# Altium schematic sheet Encoders.SchDoc: Arm - PWM Encoders
size Letter; DrawnBy: K.Hong; Organization: UW Robotics; Address1: 200 University Avenue; Address2: Waterloo; Address3: Ontario; Address4: Canada N2L 3G6; SheetNumber: 8; SheetTotal: 9
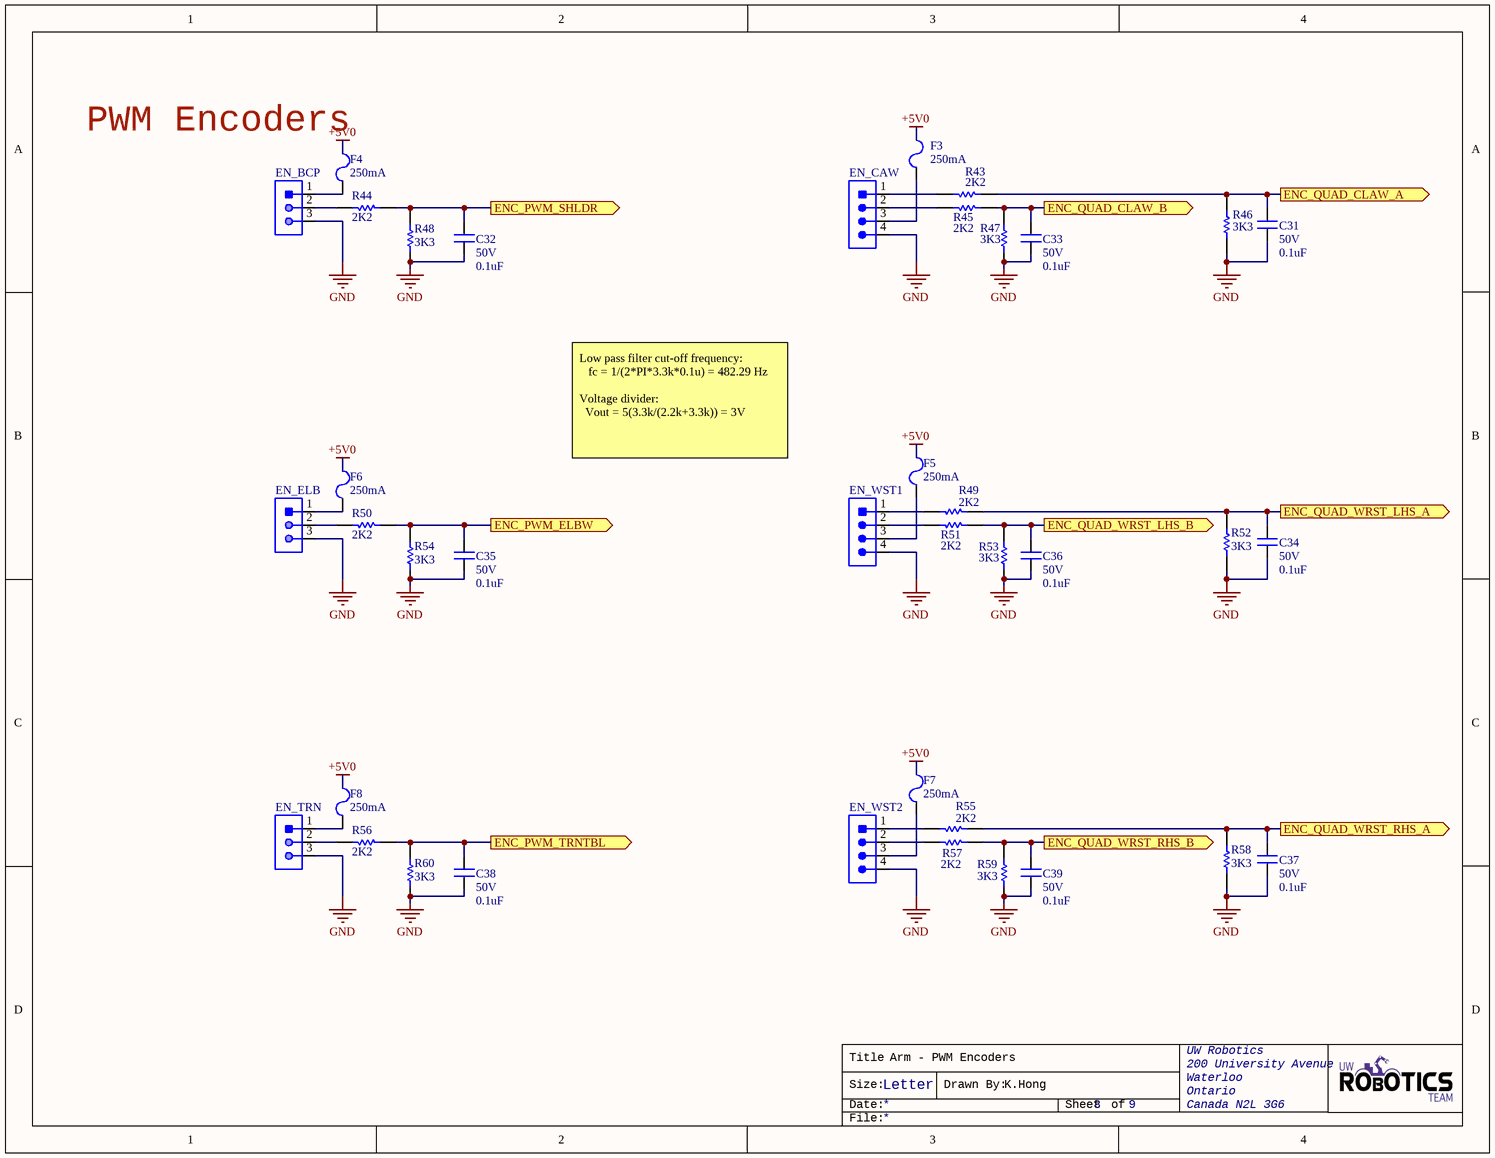
[diagram p0: Encoders.SchDoc]

## Parts
C31  value 0.1uF  Voltage Rating: 50V  [CAPC0603(1608)55_N]  (hidden comment: CAP_0.1uF_50V_0603)
C32  value 0.1uF  Voltage Rating: 50V  [CAPC0603(1608)55_N]  (hidden comment: CAP_0.1uF_50V_0603)
C33  value 0.1uF  Voltage Rating: 50V  [CAPC0603(1608)55_N]  (hidden comment: CAP_0.1uF_50V_0603)
C34  value 0.1uF  Voltage Rating: 50V  [CAPC0603(1608)55_N]  (hidden comment: CAP_0.1uF_50V_0603)
C35  value 0.1uF  Voltage Rating: 50V  [CAPC0603(1608)55_N]  (hidden comment: CAP_0.1uF_50V_0603)
C36  value 0.1uF  Voltage Rating: 50V  [CAPC0603(1608)55_N]  (hidden comment: CAP_0.1uF_50V_0603)
C37  value 0.1uF  Voltage Rating: 50V  [CAPC0603(1608)55_N]  (hidden comment: CAP_0.1uF_50V_0603)
C38  value 0.1uF  Voltage Rating: 50V  [CAPC0603(1608)55_N]  (hidden comment: CAP_0.1uF_50V_0603)
C39  value 0.1uF  Voltage Rating: 50V  [CAPC0603(1608)55_N]  (hidden comment: CAP_0.1uF_50V_0603)
EN_BCP  CON_3M_SM4  [JST-B3B-SM4-TB]  (value not drawn)
EN_CAW  CON_4M_SM4  [JST-B4B-SM4-TB]  (value not drawn)
EN_ELB  CON_3M_SM4  [JST-B3B-SM4-TB]  (value not drawn)
EN_TRN  CON_3M_SM4  [JST-B3B-SM4-TB]  (value not drawn)
EN_WST1  CON_4M_SM4  [JST-B4B-SM4-TB]  (value not drawn)
EN_WST2  CON_4M_SM4  [JST-B4B-SM4-TB]  (value not drawn)
F3  Current Rating: 250mA  [FUSE_0603]  (hidden comment: FUSE_250mA_0603)
F4  Current Rating: 250mA  [FUSE_0603]  (hidden comment: FUSE_250mA_0603)
F5  Current Rating: 250mA  [FUSE_0603]  (hidden comment: FUSE_250mA_0603)
F6  Current Rating: 250mA  [FUSE_0603]  (hidden comment: FUSE_250mA_0603)
F7  Current Rating: 250mA  [FUSE_0603]  (hidden comment: FUSE_250mA_0603)
F8  Current Rating: 250mA  [FUSE_0603]  (hidden comment: FUSE_250mA_0603)
R43  value 2K2  [RESC0603(1608)_N]  (hidden comment: RES_2K2_0603)
R44  value 2K2  [RESC0603(1608)_N]  (hidden comment: RES_2K2_0603)
R45  value 2K2  [RESC0603(1608)_N]  (hidden comment: RES_2K2_0603)
R46  value 3K3  [RESC0603(1608)_N]  (hidden comment: RES_3K3_0603)
R47  value 3K3  [RESC0603(1608)_N]  (hidden comment: RES_3K3_0603)
R48  value 3K3  [RESC0603(1608)_N]  (hidden comment: RES_3K3_0603)
R49  value 2K2  [RESC0603(1608)_N]  (hidden comment: RES_2K2_0603)
R50  value 2K2  [RESC0603(1608)_N]  (hidden comment: RES_2K2_0603)
R51  value 2K2  [RESC0603(1608)_N]  (hidden comment: RES_2K2_0603)
R52  value 3K3  [RESC0603(1608)_N]  (hidden comment: RES_3K3_0603)
R53  value 3K3  [RESC0603(1608)_N]  (hidden comment: RES_3K3_0603)
R54  value 3K3  [RESC0603(1608)_N]  (hidden comment: RES_3K3_0603)
R55  value 2K2  [RESC0603(1608)_N]  (hidden comment: RES_2K2_0603)
R56  value 2K2  [RESC0603(1608)_N]  (hidden comment: RES_2K2_0603)
R57  value 2K2  [RESC0603(1608)_N]  (hidden comment: RES_2K2_0603)
R58  value 3K3  [RESC0603(1608)_N]  (hidden comment: RES_3K3_0603)
R59  value 3K3  [RESC0603(1608)_N]  (hidden comment: RES_3K3_0603)
R60  value 3K3  [RESC0603(1608)_N]  (hidden comment: RES_3K3_0603)

## Ports
ENC_PWM_ELBW (out), ENC_PWM_SHLDR (out), ENC_PWM_TRNTBL (out), ENC_QUAD_CLAW_A (out), ENC_QUAD_CLAW_B (out), ENC_QUAD_WRST_LHS_A (out), ENC_QUAD_WRST_LHS_B (out), ENC_QUAD_WRST_RHS_A (out), ENC_QUAD_WRST_RHS_B (out)

## Nets
+5V0: F3.2 F4.2 F5.2 F6.2 F7.2 F8.2
GND: C31.1 C32.1 C33.1 C34.1 C35.1 C36.1 C37.1 C38.1 C39.1 EN_BCP.3 EN_CAW.4 EN_ELB.3 EN_TRN.3 EN_WST1.4 EN_WST2.4 R46.1 R47.1 R48.1 R52.1 R53.1 R54.1 R58.1 R59.1 R60.1
ENC_PWM_ELBW: C35.2 R50.1 R54.2 ; port ENC_PWM_ELBW
ENC_PWM_SHLDR: C32.2 R44.1 R48.2 ; port ENC_PWM_SHLDR
ENC_PWM_TRNTBL: C38.2 R56.1 R60.2 ; port ENC_PWM_TRNTBL
ENC_QUAD_CLAW_A: C31.2 R43.1 R46.2 ; port ENC_QUAD_CLAW_A
ENC_QUAD_CLAW_B: C33.2 R45.1 R47.2 ; port ENC_QUAD_CLAW_B
ENC_QUAD_WRST_LHS_A: C34.2 R49.1 R52.2 ; port ENC_QUAD_WRST_LHS_A
ENC_QUAD_WRST_LHS_B: C36.2 R51.1 R53.2 ; port ENC_QUAD_WRST_LHS_B
ENC_QUAD_WRST_RHS_A: C37.2 R55.1 R58.2 ; port ENC_QUAD_WRST_RHS_A
ENC_QUAD_WRST_RHS_B: C39.2 R57.1 R59.2 ; port ENC_QUAD_WRST_RHS_B
NetEN_BCP_1: EN_BCP.1 F4.1
NetEN_BCP_2: EN_BCP.2 R44.2
NetEN_CAW_1: EN_CAW.1 R43.2
NetEN_CAW_2: EN_CAW.2 R45.2
NetEN_CAW_3: EN_CAW.3 F3.1
NetEN_ELB_1: EN_ELB.1 F6.1
NetEN_ELB_2: EN_ELB.2 R50.2
NetEN_TRN_1: EN_TRN.1 F8.1
NetEN_TRN_2: EN_TRN.2 R56.2
NetEN_WST1_1: EN_WST1.1 R49.2
NetEN_WST1_2: EN_WST1.2 R51.2
NetEN_WST1_3: EN_WST1.3 F5.1
NetEN_WST2_1: EN_WST2.1 R55.2
NetEN_WST2_2: EN_WST2.2 R57.2
NetEN_WST2_3: EN_WST2.3 F7.1

## Notes on the sheet
- PWM Encoders
- Low pass filter cut-off frequency:
  fc = 1/(2*PI*3.3k*0.1u) = 482.29 Hz
  Voltage divider:
  Vout = 5(3.3k/(2.2k+3.3k)) = 3V
- Title
- Size:
- Date:
- Letter
- Drawn By:
- Sheet
- of
- File:

## Library data of the parts
C31-C39 = CAP_0.1uF_50V_0603: CAP CER 0.1UF 50V X7R 0603; MPN: CC0603KRX7R9BB104; Manufacturer: Yageo; Dimensions: 0.063" L x 0.031" W (1.60mm x 0.80mm); Package: 0603 (1608 Metric); Temperature Coefficient: X7R; Supplier Part Number 1: 311-1344-1-ND; Supplier 1: Digi-Key
EN_BCP EN_ELB EN_TRN = CON_3M_SM4: CONN HEADER SMD 3POS 2MM; Manufacturer: JST; Manufacturer Part Number: B3B-PH-SM4-TB(LF)(SN); Max Current Rating: 2A; Max Voltage Rating: 100V; Supplier 1: Digi-Key; Supplier Part Number 1: 455-1735-1-ND; ComponentLink1URL: https://datasheet.ciiva.com/11747/0900766b80ddea81-11747684.pdf?src-supplier=RSComponents; ComponentLink1Description: https://datasheet.ciiva.com/11747/0900766b80ddea81-11747684.pdf?src-supplier=RSComponents; Pitch: 2mm
EN_CAW EN_WST1 EN_WST2 = CON_4M_SM4: CONN HEADER SMD 4POS 2MM; Manufacturer: JST; Manufacturer Part Number: B4B-PH-SM4-TB(LF)(SN); Max Current Rating: 2A; Max Voltage Rating: 100V; Supplier 1: Digi-Key; Supplier Part Number 1: 455-1736-1-ND; ComponentLink1URL: https://datasheet.ciiva.com/8052/1699381-8052048.pdf?src-supplier=Element14; ComponentLink1Description: https://datasheet.ciiva.com/8052/1699381-8052048.pdf?src-supplier=Element14; ComponentLink2URL: https://datasheet.ciiva.com/11747/0900766b80ddea81-11747504.pdf?src-supplier=RSComponents; ComponentLink2Description: https://datasheet.ciiva.com/11747/0900766b80ddea81-11747504.pdf?src-supplier=RSComponents; ComponentLink3URL: https://datasheet.ciiva.com/6747/80567-6747409.pdf?src-supplier=Newark; ComponentLink3Description: https://datasheet.ciiva.com/6747/80567-6747409.pdf?src-supplier=Newark; ComponentLink4URL: https://datasheet.ciiva.com/727/eph-727525.pdf?src-supplier=Digi-Key; ComponentLink4Description: https://datasheet.ciiva.com/727/eph-727525.pdf?src-supplier=Digi-Key; ComponentLink5URL: https://datasheet.ciiva.com/712/eph-712582.pdf?src-supplier=Digi-Key; ComponentLink5Description: https://datasheet.ciiva.com/712/eph-712582.pdf?src-supplier=Digi-Key; ComponentLink6URL: https://datasheet.ciiva.com/712/eph-712583.pdf?src-supplier=Digi-Key; ComponentLink6Description: https://datasheet.ciiva.com/712/eph-712583.pdf?src-supplier=Digi-Key; Pitch: 2mm
F3-F8 = FUSE_250mA_0603: FUSE SMD 250mA 32V; ComponentLink1URL: https://datasheet.ciiva.com/303/467-303396.pdf?src-supplier=Digi-Key; ComponentLink1Description: https://datasheet.ciiva.com/303/467-303396.pdf?src-supplier=Digi-Key; ComponentLink2URL: https://datasheet.ciiva.com/18652/littelfuse-fuse-467-datasheet-pdf-18652490.pdf?src-supplier=Digi-Key; ComponentLink2Description: https://datasheet.ciiva.com/18652/littelfuse-fuse-467-datasheet-pdf-18652490.pdf?src-supplier=Digi-Key; ComponentLink3URL: https://datasheet.ciiva.com/18652/littelfuse-fuse-467-datasheet-pdf-18652491.pdf?src-supplier=Digi-Key; ComponentLink3Description: https://datasheet.ciiva.com/18652/littelfuse-fuse-467-datasheet-pdf-18652491.pdf?src-supplier=Digi-Key; ComponentLink4URL: https://datasheet.ciiva.com/18652/littelfuse-fuse-467-datasheet-pdf-18652492.pdf?src-supplier=Digi-Key; ComponentLink4Description: https://datasheet.ciiva.com/18652/littelfuse-fuse-467-datasheet-pdf-18652492.pdf?src-supplier=Digi-Key; Voltage Rating (AC): 32V; Voltage Rating (DC): 32V; Supplier 1: Digi-Key; Supplier Part Number 1: F6020CT-ND; Supplier Packaging 1: Cut Tape; Mount: Surface Mount
R43-R45 R49-R51 R55-R57 = RES_2K2_0603: RES SMD 2.2K OHM 1% 1/10W 0603; Manufacturer: Yageo; MPN: RC0603FR-072K2L; Dimensions: 0.063" L x 0.031" W (1.60mm x 0.80mm); Package: 0603 (1608 Metric); Tolerance: 1%; Supplier 1: Digi-Key; Supplier Part Number 1: 311-2.20KHRCT-ND
R46-R48 R52-R54 R58-R60 = RES_3K3_0603: RES SMD 3.3K OHM 5% 1/10W 0603; Manufacturer: Yageo; MPN: RC0603JR-073K3L; Dimensions: 0.063" L x 0.031" W (1.60mm x 0.80mm); Package: 0603 (1608 Metric); Tolerance: 5%; Supplier Part Number 1: 311-3.3KGRCT-ND; Supplier 1: Digi-Key; Digikey Part Number: 311-3.3KGRCT-ND